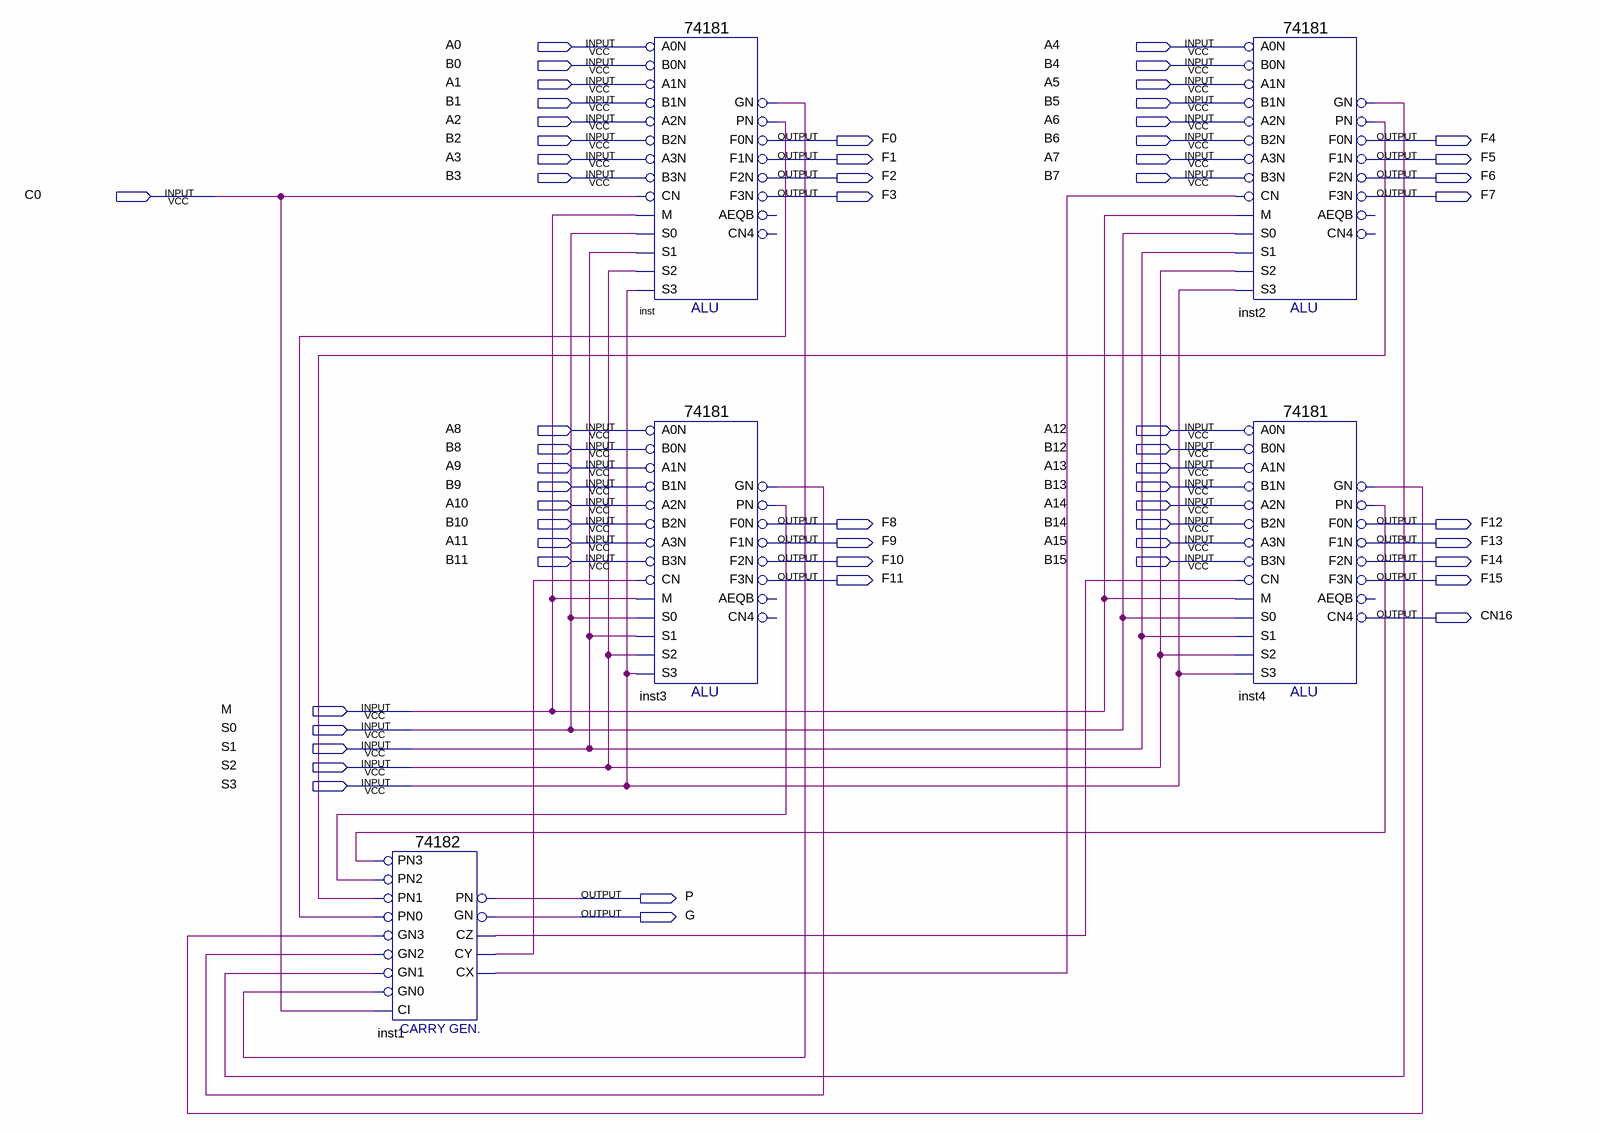
[diagram p0: schematic sheet]
// Quartus schematic parallel.bdf as structural Verilog: 5 symbols, 57 pins
module parallel (
  input  A0,
  input  A4,
  input  B0,
  input  B4,
  input  A1,
  input  A5,
  input  B1,
  input  B5,
  input  A2,
  input  A6,
  input  B2,
  input  B6,
  input  A3,
  input  A7,
  input  B3,
  input  B7,
  input  C0,
  input  A8,
  input  A12,
  input  B8,
  input  B12,
  input  A9,
  input  A13,
  input  B9,
  input  B13,
  input  A10,
  input  A14,
  input  B10,
  input  B14,
  input  A11,
  input  A15,
  input  B11,
  input  B15,
  input  M,
  input  S0,
  input  S1,
  input  S2,
  input  S3,
  output F0,
  output F4,
  output F1,
  output F5,
  output F2,
  output F6,
  output F3,
  output F7,
  output F8,
  output F12,
  output F9,
  output F13,
  output F10,
  output F14,
  output F11,
  output F15,
  output CN16,
  output P,
  output G
);

  wire inst1_cx, inst1_cy, inst1_cz, inst2_gn, inst2_pn, inst3_gn, inst3_pn, inst4_gn, inst4_pn, inst_gn,
       inst_pn;

  \74182  inst1 (
    .PN2(inst3_pn), .GN2(inst3_gn), .GN3(inst4_gn), .PN3(inst4_pn), .CI(C0), .PN1(inst2_pn), .PN0(inst_pn),
    .GN1(inst2_gn), .GN0(inst_gn), .CY(inst1_cy), .PN(P), .CX(inst1_cx), .CZ(inst1_cz), .GN(G));
  \74181  inst (
    .B0N(B0), .A0N(A0), .A1N(A1), .B1N(B1), .A3N(A3), .B2N(B2), .A2N(A2), .M(M), .CN(C0), .B3N(B3), .S2(S2),
    .S1(S1), .S0(S0), .S3(S3), .PN(inst_pn), .GN(inst_gn), .F3N(F3), .F1N(F1), .F0N(F0), .F2N(F2));  // open: AEQB, CN4
  \74181  inst3 (
    .B0N(B8), .A0N(A8), .A1N(A9), .B1N(B9), .A3N(A11), .B2N(B10), .A2N(A10), .M(M), .CN(inst1_cy), .B3N(B11),
    .S2(S2), .S1(S1), .S0(S0), .S3(S3), .PN(inst3_pn), .GN(inst3_gn), .F3N(F11), .F1N(F9), .F0N(F8), .F2N(F10));  // open: AEQB, CN4
  \74181  inst2 (
    .B0N(B4), .A0N(A4), .A1N(A5), .B1N(B5), .A3N(A7), .B2N(B6), .A2N(A6), .M(M), .CN(inst1_cx), .B3N(B7),
    .S2(S2), .S1(S1), .S0(S0), .S3(S3), .PN(inst2_pn), .GN(inst2_gn), .F3N(F7), .F1N(F5), .F0N(F4), .F2N(F6));  // open: AEQB, CN4
  \74181  inst4 (
    .B0N(B12), .A0N(A12), .A1N(A13), .B1N(B13), .A3N(A15), .B2N(B14), .A2N(A14), .M(M), .CN(inst1_cz),
    .B3N(B15), .S2(S2), .S1(S1), .S0(S0), .S3(S3), .PN(inst4_pn), .GN(inst4_gn), .F3N(F15), .F1N(F13),
    .F0N(F12), .CN4(CN16), .F2N(F14));  // open: AEQB
endmodule
